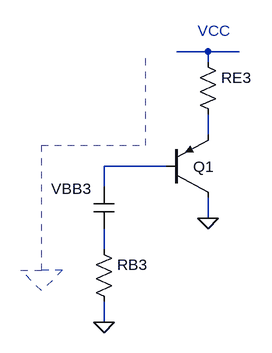
[diagram p0: schematic Draft4.asc]
Draft4.asc, the LTspice schematic file:
Version 4
SHEET 1 880 680
WIRE 224 -32 176 -32
WIRE 272 -32 224 -32
WIRE 224 -16 224 -32
WIRE 224 96 224 64
WIRE 160 144 64 144
WIRE 64 176 64 144
WIRE 224 224 224 192
WIRE 64 272 64 240
WIRE 64 384 64 352
FLAG 64 384 0
FLAG 224 224 0
SYMBOL pnp 160 192 M180
WINDOW 0 41 47 Left 2
SYMATTR InstName Q1
SYMATTR Value ""
SYMBOL res 208 -32 R0
SYMATTR InstName RE3
SYMATTR Value ""
SYMBOL res 48 256 R0
SYMATTR InstName RB3
SYMATTR Value ""
SYMBOL cap 48 176 R0
WINDOW 0 -65 3 Left 2
SYMATTR InstName VBB3
SYMATTR Value ""
TEXT 208 -64 Left 2 ;VCC
LINE Normal 128 112 128 -32 3
LINE Normal -32 112 128 112 3
LINE Normal -32 304 -32 112 3
LINE Normal 0 304 -32 304 3
LINE Normal 0 304 0 304 3
LINE Normal -64 304 -32 304 3
LINE Normal -32 336 -64 304 3
LINE Normal 0 304 -32 336 3

The netlist it stands for:
* Draft4.asc
Q1 0 N003 N002 0
RE3 N001 N002
RB3 N004 0
C§VBB3 N003 N004
.model NPN NPN
.model PNP PNP
.lib standard.bjt
* VCC
.backanno
.end